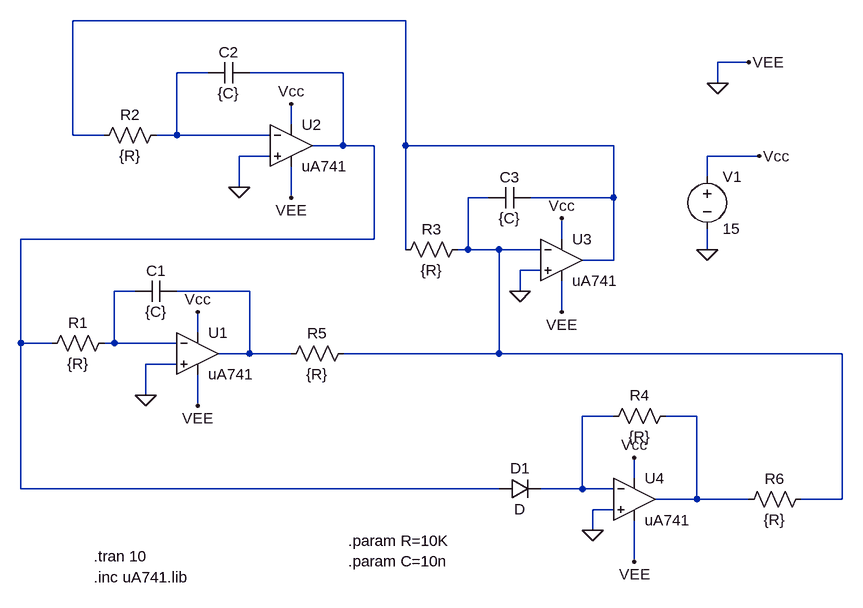
[diagram p0: schematic RandomBlinkLED.asc]
RandomBlinkLED.asc, the LTspice schematic file:
Version 4
SHEET 1 2000 680
WIRE 400 -368 -112 -368
WIRE 928 -304 880 -304
WIRE 96 -288 48 -288
WIRE 304 -288 160 -288
WIRE 880 -272 880 -304
WIRE 224 -208 224 -240
WIRE -112 -192 -112 -368
WIRE -64 -192 -112 -192
WIRE 48 -192 48 -288
WIRE 48 -192 16 -192
WIRE 192 -192 48 -192
WIRE 304 -176 304 -288
WIRE 304 -176 256 -176
WIRE 352 -176 304 -176
WIRE 400 -176 400 -368
WIRE 720 -176 400 -176
WIRE 192 -160 144 -160
WIRE 944 -160 864 -160
WIRE 864 -128 864 -160
WIRE 144 -112 144 -160
WIRE 224 -96 224 -144
WIRE 528 -96 496 -96
WIRE 720 -96 720 -176
WIRE 720 -96 592 -96
WIRE 352 -32 352 -176
WIRE 352 -32 -192 -32
WIRE 640 -32 640 -64
WIRE 400 -16 400 -176
WIRE 496 -16 496 -96
WIRE 496 -16 480 -16
WIRE 544 -16 496 -16
WIRE 608 -16 544 -16
WIRE 864 -16 864 -48
WIRE 720 0 720 -96
WIRE 720 0 672 0
WIRE 608 16 576 16
WIRE -16 48 -48 48
WIRE 160 48 48 48
WIRE 576 48 576 16
WIRE 640 80 640 32
WIRE 80 112 80 80
WIRE -192 128 -192 -32
WIRE -144 128 -192 128
WIRE -48 128 -48 48
WIRE -48 128 -64 128
WIRE 48 128 -48 128
WIRE 160 144 160 48
WIRE 160 144 112 144
WIRE 224 144 160 144
WIRE 544 144 544 -16
WIRE 544 144 304 144
WIRE 1072 144 544 144
WIRE 48 160 0 160
WIRE 0 208 0 160
WIRE 80 224 80 176
WIRE 720 240 672 240
WIRE 848 240 800 240
WIRE 752 336 752 304
WIRE -192 352 -192 128
WIRE 544 352 -192 352
WIRE 672 352 672 240
WIRE 672 352 608 352
WIRE 720 352 672 352
WIRE 848 368 848 240
WIRE 848 368 784 368
WIRE 928 368 848 368
WIRE 1072 368 1072 144
WIRE 1072 368 1008 368
WIRE 720 384 688 384
WIRE 688 416 688 384
WIRE 752 464 752 400
FLAG 0 208 0
FLAG 144 -112 0
FLAG 576 48 0
FLAG 688 416 0
FLAG 880 -272 0
FLAG 928 -304 VEE
FLAG 640 80 VEE
FLAG 224 -96 VEE
FLAG 80 224 VEE
FLAG 752 464 VEE
FLAG 864 -16 0
FLAG 944 -160 Vcc
FLAG 640 -64 Vcc
FLAG 224 -240 Vcc
FLAG 80 80 Vcc
FLAG 752 304 Vcc
SYMBOL OpAmps\\opamp2 80 80 R0
SYMATTR InstName U1
SYMATTR Value uA741
SYMBOL OpAmps\\opamp2 224 -240 R0
SYMATTR InstName U2
SYMATTR Value uA741
SYMBOL OpAmps\\opamp2 640 -64 R0
SYMATTR InstName U3
SYMATTR Value uA741
SYMBOL OpAmps\\opamp2 752 304 R0
SYMATTR InstName U4
SYMATTR Value uA741
SYMBOL res 1024 352 R90
WINDOW 0 0 56 VBottom 2
WINDOW 3 32 56 VTop 2
SYMATTR InstName R6
SYMATTR Value {R}
SYMBOL res -48 112 R90
WINDOW 0 0 56 VBottom 2
WINDOW 3 32 56 VTop 2
SYMATTR InstName R1
SYMATTR Value {R}
SYMBOL res 32 -208 R90
WINDOW 0 0 56 VBottom 2
WINDOW 3 32 56 VTop 2
SYMATTR InstName R2
SYMATTR Value {R}
SYMBOL res 496 -32 R90
WINDOW 0 0 56 VBottom 2
WINDOW 3 32 56 VTop 2
SYMATTR InstName R3
SYMATTR Value {R}
SYMBOL res 816 224 R90
WINDOW 0 0 56 VBottom 2
WINDOW 3 32 56 VTop 2
SYMATTR InstName R4
SYMATTR Value {R}
SYMBOL res 320 128 R90
WINDOW 0 0 56 VBottom 2
WINDOW 3 32 56 VTop 2
SYMATTR InstName R5
SYMATTR Value {R}
SYMBOL cap 48 32 R90
WINDOW 0 0 32 VBottom 2
WINDOW 3 32 32 VTop 2
SYMATTR InstName C1
SYMATTR Value {C}
SYMBOL cap 160 -304 R90
WINDOW 0 0 32 VBottom 2
WINDOW 3 32 32 VTop 2
SYMATTR InstName C2
SYMATTR Value {C}
SYMBOL cap 592 -112 R90
WINDOW 0 0 32 VBottom 2
WINDOW 3 32 32 VTop 2
SYMATTR InstName C3
SYMATTR Value {C}
SYMBOL diode 544 368 R270
WINDOW 0 32 32 VTop 2
WINDOW 3 0 32 VBottom 2
SYMATTR InstName D1
SYMBOL voltage 864 -144 R0
WINDOW 123 0 0 Left 0
WINDOW 39 0 0 Left 0
SYMATTR InstName V1
SYMATTR Value 15
TEXT -80 488 Left 2 !.inc uA741.lib
TEXT -80 456 Left 2 !.tran 10
TEXT 312 432 Left 2 !.param R=10K\n.param C=10n

The netlist it stands for:
* RandomBlinkLED.asc
XU1 0 N005 Vcc 0 N006 uA741  ; pins In+ In- V+ V- OUT
XU2 0 N002 Vcc 0 N003 uA741  ; pins In+ In- V+ V- OUT
XU3 0 N004 Vcc 0 N001 uA741  ; pins In+ In- V+ V- OUT
XU4 0 N007 Vcc 0 N008 uA741  ; pins In+ In- V+ V- OUT
R6 N004 N008 {R}
R1 N005 N003 {R}
R2 N002 N001 {R}
R3 N004 N001 {R}
R4 N008 N007 {R}
R5 N004 N006 {R}
C1 N006 N005 {C}
C2 N003 N002 {C}
C3 N001 N004 {C}
D1 N003 N007 D
V1 Vcc 0 15
.model D D
.lib standard.dio
.inc uA741.lib
.tran 10
.param R=10K
.param C=10n
.backanno
.end